# Altium project ECE4095- Project 1- Speaker - V2.PrjPcb
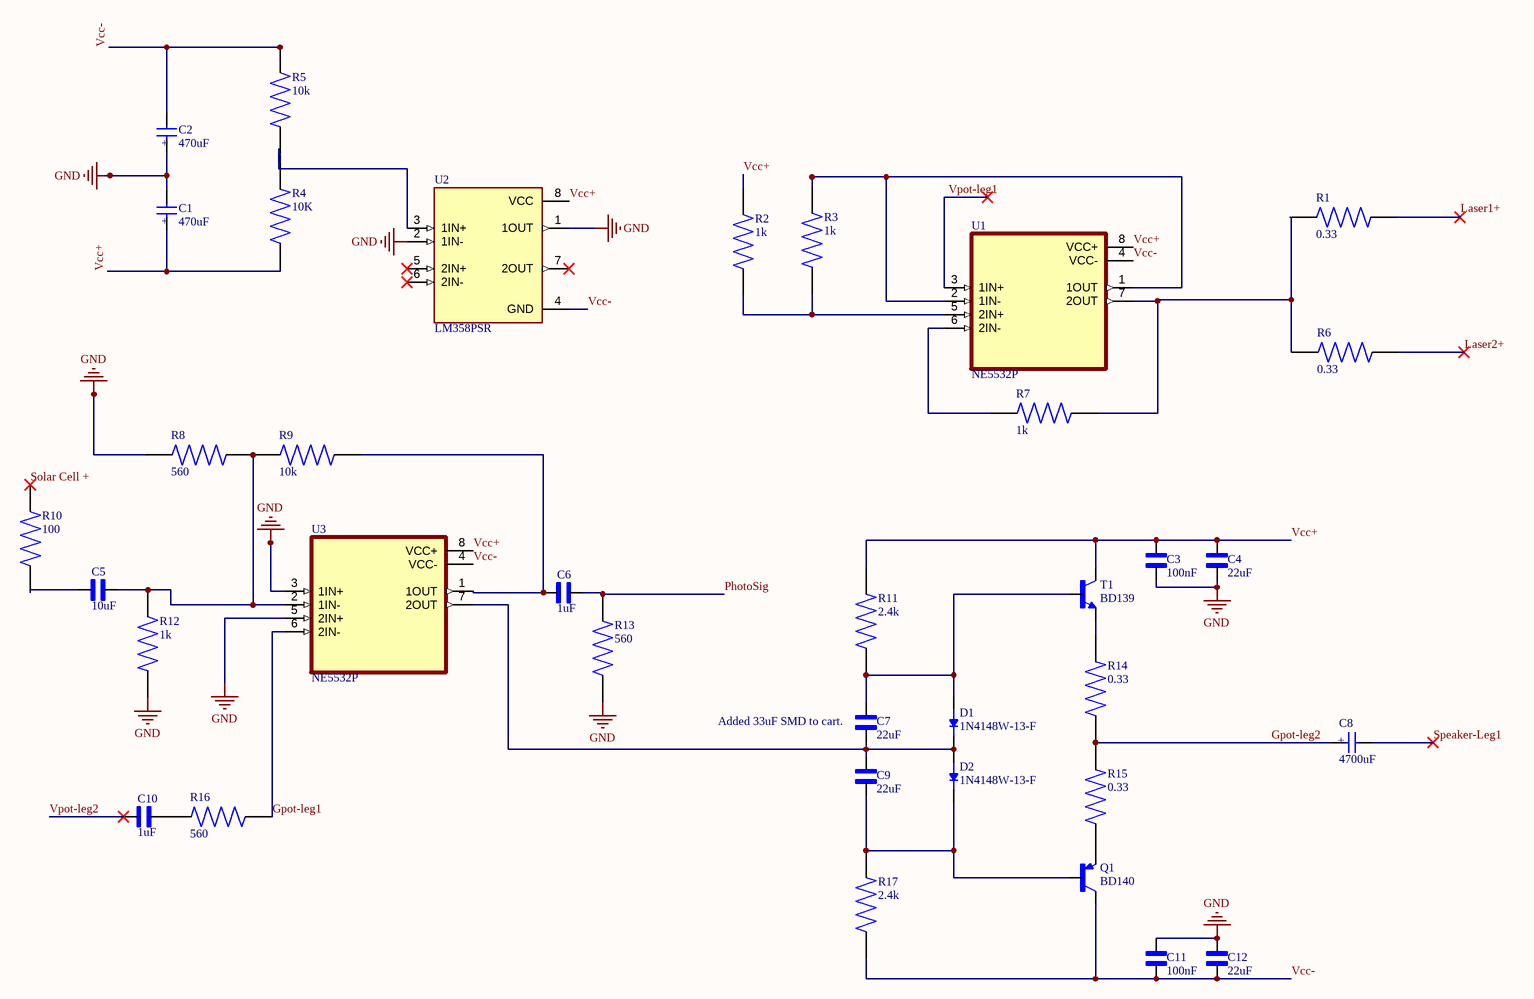
[diagram p0: Main_Schematic.SchDoc]
CAGE_CODE: ?????; CONTRACT_NUMBER: <CONTRACT NO>; DOC_NO_ASSY_DWG: <ASSY DWG NO>; DOC_NO_BOM: <BOM DOC NO>; DOC_NO_FAB_DWG: <FAB DWG NO>; DOC_NO_SCH_DWG: <SCH DWG NO>; PCB_2_DEC_TOL: +/-.01; PCB_3_DEC_TOL: +/-.010; PCB_ANG_TOL: +/-1/2; PCB_ASSEMBLY_NO: <PCB ASSY NO>; PCB_CHECKER: - -----; PCB_CHECKER_APP_DATE: --/--/----; PCB_DESIGNER: - -----; PCB_DESIGNER_APP_DATE: --/--/----; PCB_DWG_NO: <PCB DWG NO>; PCB_ENGINEER: - -----; PCB_ENGINEER_APP_DATE: --/--/----; PCB_PART_NUMBER: <PCB PN>; PCB_REV: A; SCH_REV: A
1 sheet, 36 parts. Net scope: global (net labels, ports and power ports of the same name join across sheets).
Board file: PCB1.PcbDoc

## Sheet Main_Schematic.SchDoc
size 594 x 420 mm; SheetNumber: 1; SheetTotal: 1; ENG_APP_DATE: --/--/--; DSN_APP_DATE: --/--/--; CHK_APP_DATE: --/--/--

### Parts
C1  value 470uF  [WCAP-ATG8_5X11(DXL)]  (hidden comment: WCAP-ATG8_5X11)
C2  value 470uF  [WCAP-ATG8_5X11(DXL)]  (hidden comment: WCAP-ATG8_5X11)
C3  value 100nF  [CAPC3216X180N]  (hidden comment: CL31B106KAHNNNE)
C4  value 22uF  [CAPC3216X180N]  (hidden comment: CL31B106KAHNNNE)
C5  value 10uF  [CAPC3216X180N]  (hidden comment: CL31B106KAHNNNE)
C6  value 1uF  [CAPC3216X180N]  (hidden comment: CL31B106KAHNNNE)
C7  value 22uF  [CAPC3216X180N]  (hidden comment: CL31B106KAHNNNE)
C8  value 4700uF  [WCAP-ATG8_5X11(DXL)]  (hidden comment: WCAP-ATG8_5X11)
C9  value 22uF  [CAPC3216X180N]  (hidden comment: CL31B106KAHNNNE)
C10  value 1uF  [CAPC3216X180N]  (hidden comment: CL31B106KAHNNNE)
C11  value 100nF  [CAPC3216X180N]  (hidden comment: CL31B106KAHNNNE)
C12  value 22uF  [CAPC3216X180N]  (hidden comment: CL31B106KAHNNNE)
D1  1N4148W-13-F  [SOD3715X135N]
D2  1N4148W-13-F  [SOD3715X135N]
Q1  BD140  [BD139- TO Model]
R1  value 0.33  [RESAD1100W55L680D260]  (hidden comment: MFR-25FRF52-10K5)
R2  value 1k  [RESC3216X70N]  (hidden comment: RMCF1206ZT0R00)
R3  value 1k  [RESC3216X70N]  (hidden comment: RMCF1206ZT0R00)
R4  value 10K  [RESC3216X70N]  (hidden comment: RMCF1206ZT0R00)
R5  value 10k  [RESC3216X70N]  (hidden comment: RMCF1206ZT0R00)
R6  value 0.33  [RESAD1100W55L680D260]  (hidden comment: MFR-25FRF52-10K5)
R7  value 1k  [RESC3216X70N]  (hidden comment: RMCF1206ZT0R00)
R8  value 560  [RESC3216X70N]  (hidden comment: RMCF1206ZT0R00)
R9  value 10k  [RESC3216X70N]  (hidden comment: RMCF1206ZT0R00)
R10  value 100  [RESC3216X70N]  (hidden comment: RMCF1206ZT0R00)
R11  value 2.4k  [RESC3216X70N]  (hidden comment: RMCF1206ZT0R00)
R12  value 1k  [RESC3216X70N]  (hidden comment: RMCF1206ZT0R00)
R13  value 560  [RESC3216X70N]  (hidden comment: RMCF1206ZT0R00)
R14  value 0.33  [RESAD1100W55L680D260]  (hidden comment: MFR-25FRF52-10K5)
R15  value 0.33  [RESAD1100W55L680D260]  (hidden comment: MFR-25FRF52-10K5)
R16  value 560  [RESC3216X70N]  (hidden comment: RMCF1206ZT0R00)
R17  value 2.4k  [RESC3216X70N]  (hidden comment: RMCF1206ZT0R00)
T1  BD139  [BD139-TO]
U1  NE5532P  [DIP794W45P254L959H508Q8]
U2  LM358PSR  [SOIC127P780X200-8N]
U3  NE5532P  [DIP794W45P254L959H508Q8]

### Nets
GND: C1.2(NEG) C2.1(POS) C3.1 C4.1 C11.2 C12.2 R8.1 R12.2 R13.1 U2.1(1OUT) U2.2(1IN-) U3.3(1IN+) U3.5(2IN+)
Gpot-leg1: R16.2 U3.6(2IN-)
Gpot-leg2: C8.1(POS) R14.1 R15.2
Laser1+: R1.1
Laser2+: R6.1
PhotoSig: C6.2 R13.2
Solar Cell +: R10.1
Speaker-Leg1: C8.2(NEG)
Vcc+: C1.1(POS) C3.2 C4.2 R2.2 R4.2 R11.2 T1.2(C) U1.8(VCC+) U2.8(VCC) U3.8(VCC+)
Vcc-: C2.2(NEG) C11.1 C12.1 Q1.2(C) R5.1 R17.1 U1.4(VCC-) U2.4(GND) U3.4(VCC-)
Vpot-leg1: U1.3(1IN+)
Vpot-leg2: C10.1
NetC5_1: C5.1 R10.2
NetC5_2: C5.2 R8.2 R9.1 R12.1 U3.2(1IN-)
NetC6_1: C6.1 R9.2 U3.1(1OUT)
NetC7_1: C7.1 C9.2 D1.C(K) D2.A U3.7(2OUT)
NetC7_2: C7.2 D1.A R11.1 T1.1(B)
NetC9_1: C9.1 D2.C(K) Q1.3(B) R17.2
NetC10_2: C10.2 R16.1
NetQ1_1: Q1.1(E) R15.1
NetR1_2: R1.2 R6.2 R7.1 U1.7(2OUT)
NetR2_1: R2.1 R3.1 U1.5(2IN+)
NetR3_2: R3.2 U1.1(1OUT) U1.2(1IN-)
NetR4_1: R4.1 R5.2
NetR7_2: R7.2 U1.6(2IN-)
NetR14_2: R14.2 T1.3(E)

Not connected (* = marked no-connect by the designer): U2 3(1IN+) 5(2IN+)* 6(2IN-)* 7(2OUT)*

### Notes on the sheet
- (near C7) Added 33uF SMD to cart.
- DWG NO:
- REV:
- THIS DOCUMENT AND THE DATA DISCLOSED HEREIN OR
- HEREWITH IS THE PROPERTY OF ALTIUM LIMITED AND MAY
- BE FREELY DISTRIBUTED IN WHOLE. NO RIGHTS ARE
- RESERVED OR EXPRESS OR IMPLIED WARANTEE GIVEN.
- REVISION
- DESCRIPTION
- DATE
- APPROVED
- ENG:
- APPROVALS
- PROJECT
- DSN:
- CHK:
- REFERENCE DOCUMENTS
- PROJECT REVISION:
- TITLE
- DOCUMENT REVISION:
- DESIGN ITEM:
- BOM:
- FAB DWG:
- PCB DWG:
- ASSY DWG:
- SCALE:
- A2
- SIZE
- CAGE CODE
- FILE NAME
- DWG NO.
- SHEET
- OF
- REV
- (in symbol CMP-001-00083-1) +

### Library data of the parts
C1 C2 C8 = CMP-001-00083-1: CAP ALUM 33UF 20% 35V RADIAL TH; MP: 860010572004; MF: WÃ¼rth Elektronik; SnapEDA_Link: https://www.snapeda.com/parts/860010572004/W%25C3%25BCrth+Elektronik+Midcom/view-part/?ref=snap; Case/Package: Radial Wurth Electronics; Pins: 2; Source: WCAP-ATG8_5X11.SchLib; Design Item ID: WCAP-ATG8_5X11; Check_prices: https://www.snapeda.com/parts/860010572004/W%25C3%25BCrth+Elektronik+Midcom/view-part/?ref=eda; Component Type: Standard
C3-C7 C9-C12 = CMP-001-00084-1: CL31 Series 10 uF 25 V Â±10 % Tolerance X7R SMT Multilayer Ceramic Capacitor; MF: Samsung Electro-Mechanics; Pins: 2; Design Item ID: CL31B106KAHNNNE; Case/Package: SMD-2 Samsung; Component Type: Standard; Source: CL31B106KAHNNNE.SchLib; Check_prices: https://www.snapeda.com/parts/CL31B106KAHNNNE/Samsung/view-part/?ref=eda; MP: CL31B106KAHNNNE; SnapEDA_Link: https://www.snapeda.com/parts/CL31B106KAHNNNE/Samsung/view-part/?ref=snap
D1 D2 = CMP-004-00031-1: Diode Switching 100V 0.15A 2Pin SOD123; MF: Diodes Inc.; Case/Package: SOD-123 Fairchild Semiconductor; Source: 1N4148W-13-F.SchLib; Value: *; Pins: 2; Check_prices: https://www.snapeda.com/parts/1N4148W-13-F/Diodes+Inc./view-part/?ref=eda; Component Type: Standard; MP: 1N4148W-13-F; Design Item ID: 1N4148W-13-F; SnapEDA_Link: https://www.snapeda.com/parts/1N4148W-13-F/Diodes+Inc./view-part/?ref=snap
Q1 = CMP-019-000000-2: Bipolar (BJT) Transistor PNP 80 V 1.5 A - 1.25 W Through Hole TO-126-3; MF: ON Semiconductor; Pin Count: 3; MP: BD140; Component Type: Standard; Package: TO-225-3 ON Semiconductor; Source: BD140.SchLib; Check_prices: https://www.snapeda.com/parts/BD140/Onsemi/view-part/?ref=eda; SnapEDA_Link: https://www.snapeda.com/parts/BD140/Onsemi/view-part/?ref=snap; Design Item ID: BD140; Value: *
R1 R6 R14 R15 = CMP-009-00179-1: 10.5 kOhms Â±1% 0.25W, 1/4W Through Hole Resistor Axial - Metal Film; MF: Yageo; SnapEDA_Link: https://www.snapeda.com/parts/MFR-25FRF52-10K5/Yageo/view-part/?ref=snap; Pins: 2; Component Type: Standard; Check_prices: https://www.snapeda.com/parts/MFR-25FRF52-10K5/Yageo/view-part/?ref=eda; Design Item ID: MFR-25FRF52-10K5; Source: MFR-25FRF52-10K5.SchLib; Case/Package: RADIAL-2 YAGEO; MP: MFR-25FRF52-10K5
R2-R5 R7-R13 R16 R17 = CMP-009-00177-1: 0 Ohms Jumper 0.25W, 1/4W Chip Resistor 1206 (3216 Metric) Automotive AEC-Q200 Thick Film; MF: Stackpole Electronics Inc; Check_prices: https://www.snapeda.com/parts/RMCF1206ZT0R00/Stackpole+Electronics/view-part/?ref=eda; SnapEDA_Link: https://www.snapeda.com/parts/RMCF1206ZT0R00/Stackpole+Electronics/view-part/?ref=snap; Component Type: Standard; Pins: 2; MP: RMCF1206ZT0R00; Design Item ID: RMCF1206ZT0R00; Case/Package: 3216 Stackpole; Source: RMCF1206ZT0R00.SchLib
T1 = CMP-012-00001-3: Bipolar (BJT) Transistor NPN 80 V 1.5 A - 1.25 W Through Hole TO-126-3; MF: ON; SnapEDA_Link: https://www.snapeda.com/parts/BD139/Onsemi/view-part/?ref=snap; MP: BD139; Source: BD139.SchLib; Value: *; Check_prices: https://www.snapeda.com/parts/BD139/Onsemi/view-part/?ref=eda; Component Type: Standard; Pins: 3; Design Item ID: BD139; Case/Package: TO-126 STMicroelectronics
U1 U3 = CMP-014-00003-1: Dual, 30-V, 10-MHz, low-noise operational amplifier for audio applications; MF: Texas Instruments; Case/Package: PDIP-8 Texas; Value: *; MP: NE5532P; Component Type: Standard; SnapEDA_Link: https://www.snapeda.com/parts/NE5532P/Texas+Instruments/view-part/?ref=snap; Design Item ID: NE5532P; Source: NE5532P.SchLib; Pins: 8; Check_prices: https://www.snapeda.com/parts/NE5532P/Texas+Instruments/view-part/?ref=eda
U2 = CMP-014-00004-1: Dual, 30-V, 700-kHz operational amplifier; MF: Texas Instruments; Source: LM358PSR.SchLib; SnapEDA_Link: https://www.snapeda.com/parts/LM358PSR/Texas+Instruments/view-part/?ref=snap; MP: LM358PSR; Design Item ID: LM358PSR; Pins: 8; Component Type: Standard; Value: *; Case/Package: SOP-8 Texas Instruments; Check_prices: https://www.snapeda.com/parts/LM358PSR/Texas+Instruments/view-part/?ref=eda